# Altium schematic sheet [4]-MCU_POWER.SchDoc
size A4
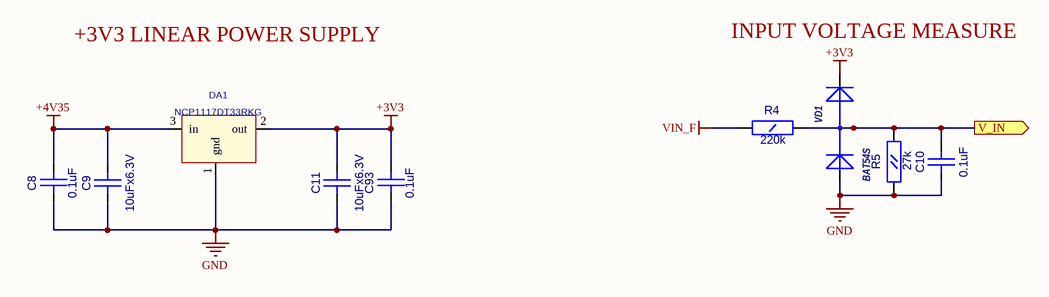
[diagram p0: [4]-MCU_POWER.SchDoc]

## Parts
C8  0.1uF  [CC0603]
C9  10uFx6.3V  [CC0805]
C10  0.1uF  [CC0603]
C11  10uFx6.3V  [CC0805]
C93  0.1uF  [CC0603]
DA1  NCP1117DT33RKG  [SOT-223]
R4  220k  [RC1206]
R5  27k  [RC0603]
VD1  BAT54S  [SOT-23(GSD)]

## Ports
V_IN (out)

## Nets
+3V3: C11.2(B) C93.1(A) DA1.2(out) VD1.2(K)
+4V35: C8.1(A) C9.2(B) DA1.3(in)
GND: C8.2(B) C9.1(A) C10.1(A) C11.1(A) C93.2(B) DA1.1(gnd) R5.1(A) VD1.1(A)
VIN_F: R4.1(A)
V_IN: C10.2(B) R4.2(B) R5.2(B) VD1.3(AK) ; port V_IN

## Notes on the sheet
- +3V3 LINEAR POWER SUPPLY
- (near VD1) INPUT VOLTAGE MEASURE

## Library data of the parts
C8 C10 C93 = CC0603: Value: 0.1uF
C9 C11 = CC0805: Value: 10uFx6.3V
DA1 = NCP1117DT33RKG: Linear Regulator 3.3V; Value: *
R4 = RC1206: Value: 220k
R5 = RC0603: Value: 27k
VD1 = BAT54S: 1.0 Ampere General Purpose Rectifier; ComponentField6: Published 8-Jun-2000, Modified 11-July-2000: SIM Model Added.; Value: *